# Altium project STM32H750VBT6.PrjPcb
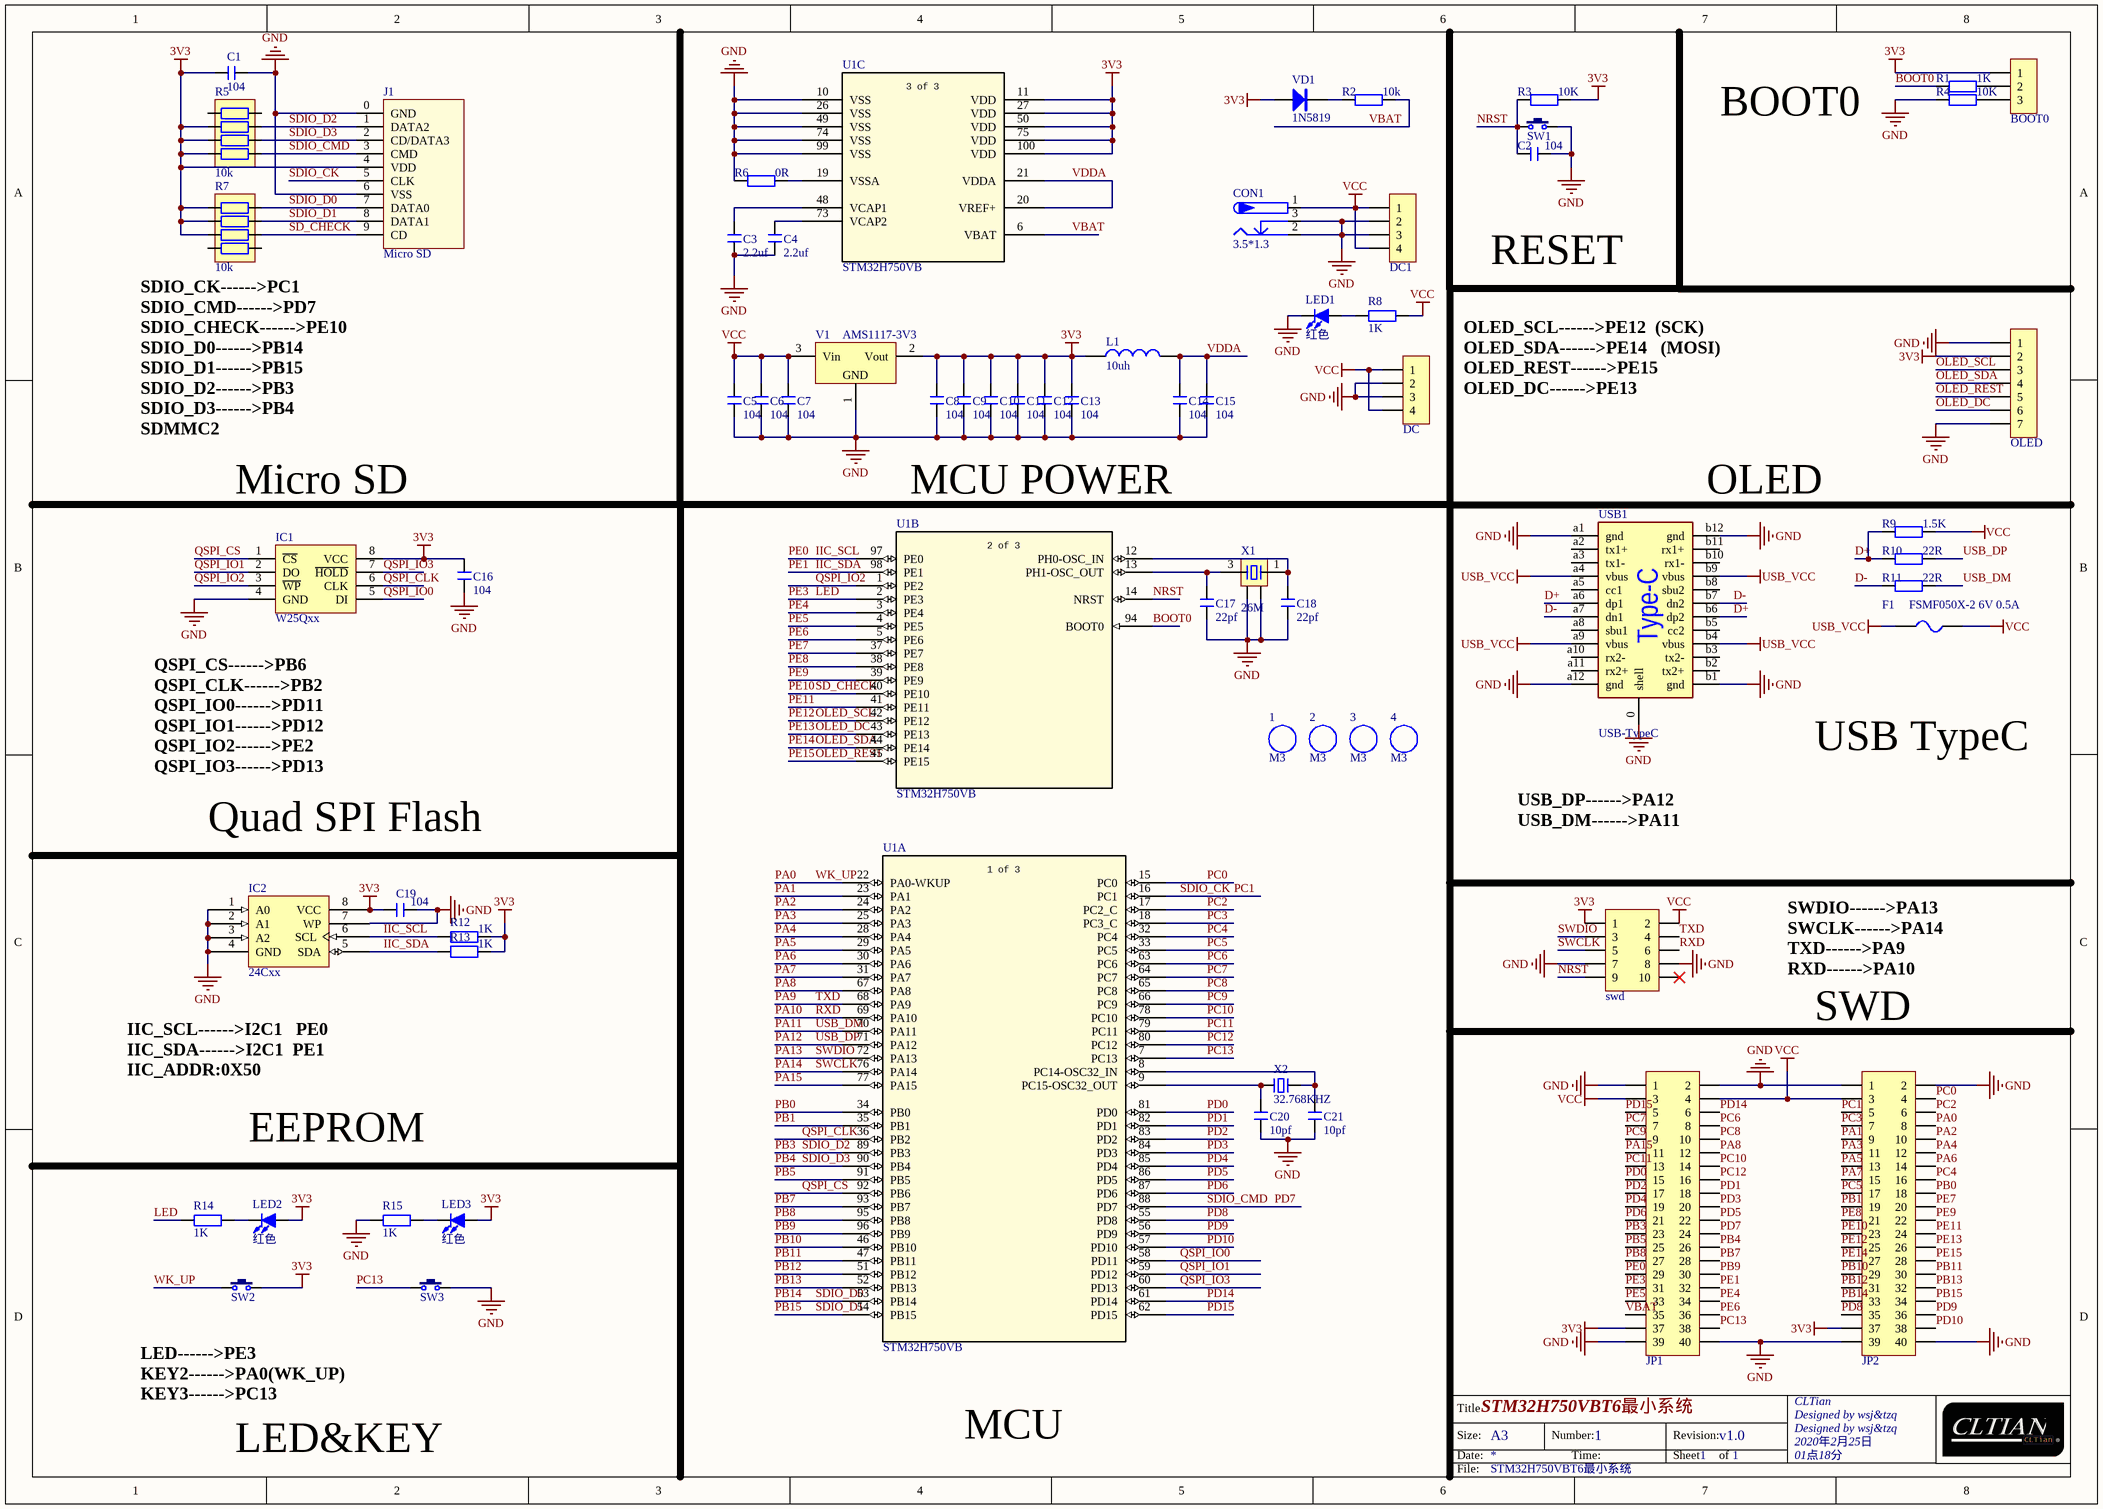
[diagram p0: Sheet1.SchDoc]
1 sheet, 65 parts. Net scope: global (net labels, ports and power ports of the same name join across sheets).
Board file: PCB1.PcbDoc

## Sheet Sheet1.SchDoc: STM32H750VBT6最小系统
size A3; CheckedBy: Designed by wsj&tzq; Author: Designed by wsj&tzq; DrawnBy: Designed by wsj&tzq; Engineer: 2020年2月25日; Organization: CLTian; Address1: Designed by wsj&tzq; Address2: 2020年2月25日; Address3: 01点18分; DocumentNumber: 1; Revision: v1.0; SheetNumber: 1; SheetTotal: 1; DocumentFullPathAndName: STM32H750VBT6最小系统; DocumentName: STM32H750VBT6最小系统; ImagePath: 01点18分; ProjectName: STM32H750VBT6最小系统

### Parts
1  M3  [M3 125X200]
2  M3  [M3 125X200]
3  M3  [M3 125X200]
4  M3  [M3 125X200]
BOOT0  HDR-1X3  [HDR-1X3]  (value not drawn)
C1  104  [C 0603]
C2  104  [C 0603]
C3  2.2uf  [C 0603]
C4  2.2uf  [C 0603]
C5  104  [C 0603]
C6  104  [C 0603]
C7  104  [C 0603]
C8  104  [C 0603]
C9  104  [C 0603]
C10  104  [C 0603]
C11  104  [C 0603]
C12  104  [C 0603]
C13  104  [C 0603]
C14  104  [C 0603]
C15  104  [C 0603]
C16  104  [C 0603]
C17  22pf  [C 0603]
C18  22pf  [C 0603]
C19  104  [C 0603]
C20  10pf  [C 0603]
C21  10pf  [C 0603]
CON1  3.5*1.3  [DC-005]
DC  HDR-1X4  [PH2.0 D-W-4P]  (value not drawn)
DC1  HDR-1X4  [PH2.0 D-W-4P]  (value not drawn)
F1  FSMF050X-2 6V 0.5A  [FU 0603]
IC1  W25Qxx  [SOP8W_N]
IC2  24Cxx  [SOP8_L]
J1  Micro SD  [Micro SD]
JP1  Header 2X11  [HDR-20X2]  (value not drawn)
JP2  Header 2X11  [HDR-20X2]  (value not drawn)
L1  10uh  [L 0603]
LED1  红色  [LED 0805G]
LED2  红色  [LED 0603B]
LED3  红色  [LED 0603B]
OLED  HDR-1X7  [HDR-1X7]  (value not drawn)
R1  1K  [R 0603-HP]
R2  10k  [R 0603-HP]
R3  10K  [R 0603-HP]
R4  10K  [R 0603-HP]
R5  10k  [RCA-8P4R-0402]
R6  0R  [R 0603-HP]
R7  10k  [RCA-8P4R-0402]
R8  1K  [R 0805]
R9  1.5K  [R 0603-HP]
R10  22R  [R 0603-HP]
R11  22R  [R 0603-HP]
R12  1K  [R 0603-HP]
R13  1K  [R 0603-HP]
R14  1K  [R 0603-HP]
R15  1K  [R 0603-HP]
SW1  3x6x5  [TSW SMD-3*6*2.5]  (value not drawn)
SW2  3x6x5  [TSW SMD-3*6*2.5]  (value not drawn)
SW3  3x6x5  [TSW SMD-3*6*2.5]  (value not drawn)
swd  Header 5X2  [HDR-5X2]  (value not drawn)
U1  STM32H750VB  [LQFP100-14x14mm]  (parts A,B,C of 3)
USB1  USB-TypeC  [USB_TypeC]
V1  AMS1117-3V3  [SOT223_L]
VD1  1N5819  [SOD-323]
X1  26M  [XTAL-3225]
X2  32.768KHZ  [XTAL-3215]

### Nets
3V3: BOOT0.1 C1.2 C8.2 C9.2 C10.2 C11.2 C12.2 C13.2 C16.2 C19.2 IC1.8(VCC) IC2.8(VCC) J1.4(VDD) JP1.37 JP2.37 L1.1 LED2.1(A) LED3.1(A) OLED.2 R3.1 R5.2 R5.3 R5.4 R7.1 R7.2 R7.3 R12.2 R13.2 SW2.2 swd.1 U1.11(VDD) U1.27(VDD) U1.50(VDD) U1.75(VDD) U1.100(VDD) V1.2(Vout) VD1.1(A)
GND: C1.1 C2.2 C3.1 C4.1 C5.1 C6.1 C7.1 C8.1 C9.1 C10.1 C11.1 C12.1 C13.1 C14.1 C15.1 C16.1 C17.1 C18.1 C19.1 C20.1 C21.1 CON1.2 CON1.3 DC.2 DC.3 DC1.2 DC1.3 IC1.4(GND) IC2.1(A0) IC2.2(A1) IC2.3(A2) IC2.4(GND) IC2.7(WP) J1.0(GND) J1.6(VSS) JP1.1 JP1.2 JP1.39 JP1.40 JP2.1 JP2.2 JP2.39 JP2.40 LED1.2(K) OLED.1 OLED.7 R4.1 R6.2 R15.1 SW1.2 SW3.2 swd.7 swd.8 U1.10(VSS) U1.26(VSS) U1.49(VSS) U1.74(VSS) U1.99(VSS) USB1.0(shell) USB1.a1(gnd) USB1.a12(gnd) USB1.b1(gnd) USB1.b12(gnd) V1.1(GND) X1.2 X1.4
USB_VCC: F1.1 USB1.a4(vbus) USB1.a9(vbus) USB1.b4(vbus) USB1.b9(vbus)
VCC: C5.2 C6.2 C7.2 CON1.1 DC.1 DC.4 DC1.1 DC1.4 F1.2 JP1.3 JP1.4 JP2.3 R8.2 R9.2 swd.2 V1.3(Vin)
BOOT0: R1.1 U1.94(BOOT0)
D+: R9.1 R10.1 USB1.a6(dp1) USB1.b6(dp2)
D-: R11.1 USB1.a7(dn1) USB1.b7(dn2)
IIC_SCL: IC2.6(SCL) JP1.29 R12.1 U1.97(PE0)  [also labelled PE0]
IIC_SDA: IC2.5(SDA) JP1.32 R13.1 U1.98(PE1)  [also labelled PE1]
LED: JP1.31 R14.1 U1.2(PE3)  [also labelled PE3]
NRST: C2.1 R3.2 SW1.1 swd.9 U1.14(NRST)
OLED_DC: JP2.26 OLED.6 U1.43(PE13)  [also labelled PE13]
OLED_REST: JP2.28 OLED.5 U1.45(PE15)  [also labelled PE15]
OLED_SCL: JP2.25 OLED.3 U1.42(PE12)  [also labelled PE12]
OLED_SDA: JP2.27 OLED.4 U1.44(PE14)  [also labelled PE14]
PA0: JP2.8 SW2.1 U1.22(PA0-WKUP)  [also labelled WK_UP]
PA1: JP2.9 U1.23(PA1)
PA2: JP2.10 U1.24(PA2)
PA3: JP2.11 U1.25(PA3)
PA4: JP2.12 U1.28(PA4)
PA5: JP2.13 U1.29(PA5)
PA6: JP2.14 U1.30(PA6)
PA7: JP2.15 U1.31(PA7)
PA8: JP1.12 U1.67(PA8)
PA9: swd.4 U1.68(PA9)  [also labelled TXD]
PA10: swd.6 U1.69(PA10)  [also labelled RXD]
PA11: R11.2 U1.70(PA11)  [also labelled USB_DM]
PA12: R10.2 U1.71(PA12)  [also labelled USB_DP]
PA13: swd.3 U1.72(PA13)  [also labelled SWDIO]
PA14: swd.5 U1.76(PA14)  [also labelled SWCLK]
PA15: JP1.11 U1.77(PA15)
PB0: JP2.18 U1.34(PB0)
PB1: JP2.19 U1.35(PB1)
PB3: J1.1(DATA2) JP1.23 R5.7 U1.89(PB3)  [also labelled SDIO_D2]
PB4: J1.2(CD/DATA3) JP1.26 R5.6 U1.90(PB4)  [also labelled SDIO_D3]
PB5: JP1.25 U1.91(PB5)
PB7: JP1.28 U1.93(PB7)
PB8: JP1.27 U1.95(PB8)
PB9: JP1.30 U1.96(PB9)
PB10: JP2.29 U1.46(PB10)
PB11: JP2.30 U1.47(PB11)
PB12: JP2.31 U1.51(PB12)
PB13: JP2.32 U1.52(PB13)
PB14: J1.7(DATA0) JP2.33 R7.8 U1.53(PB14)  [also labelled SDIO_D0]
PB15: J1.8(DATA1) JP2.34 R7.7 U1.54(PB15)  [also labelled SDIO_D1]
PC0: JP2.4 U1.15(PC0)
PC1: J1.5(CLK) JP2.5 U1.16(PC1)  [also labelled SDIO_CK]
PC2: JP2.6 U1.17(PC2_C)
PC3: JP2.7 U1.18(PC3_C)
PC4: JP2.16 U1.32(PC4)
PC5: JP2.17 U1.33(PC5)
PC6: JP1.8 U1.63(PC6)
PC7: JP1.7 U1.64(PC7)
PC8: JP1.10 U1.65(PC8)
PC9: JP1.9 U1.66(PC9)
PC10: JP1.14 U1.78(PC10)
PC11: JP1.13 U1.79(PC11)
PC12: JP1.16 U1.80(PC12)
PC13: JP1.38 SW3.1 U1.7(PC13)
PD0: JP1.15 U1.81(PD0)
PD1: JP1.18 U1.82(PD1)
PD2: JP1.17 U1.83(PD2)
PD3: JP1.20 U1.84(PD3)
PD4: JP1.19 U1.85(PD4)
PD5: JP1.22 U1.86(PD5)
PD6: JP1.21 U1.87(PD6)
PD7: J1.3(CMD) JP1.24 R5.5 U1.88(PD7)  [also labelled SDIO_CMD]
PD8: JP2.35 U1.55(PD8)
PD9: JP2.36 U1.56(PD9)
PD10: JP2.38 U1.57(PD10)
PD14: JP1.6 U1.61(PD14)
PD15: JP1.5 U1.62(PD15)
PE4: JP1.34 U1.3(PE4)
PE5: JP1.33 U1.4(PE5)
PE6: JP1.36 U1.5(PE6)
PE7: JP2.20 U1.37(PE7)
PE8: JP2.21 U1.38(PE8)
PE9: JP2.22 U1.39(PE9)
PE10: J1.9(CD) JP2.23 R7.6 U1.40(PE10)  [also labelled SD_CHECK]
PE11: JP2.24 U1.41(PE11)
QSPI_CLK: IC1.6(CLK) U1.36(PB2)
QSPI_CS: IC1.1(~{CS}) U1.92(PB6)
QSPI_IO0: IC1.5(DI) U1.58(PD11)
QSPI_IO1: IC1.2(DO) U1.59(PD12)
QSPI_IO2: IC1.3(~{WP}) U1.1(PE2)
QSPI_IO3: IC1.7(~{HOLD}) U1.60(PD13)
VBAT: JP1.35 R2.1 U1.6(VBAT)
VDDA: C14.2 C15.2 L1.2 U1.20(VREF+) U1.21(VDDA)
NetBOOT0_2: BOOT0.2 R1.2
NetBOOT0_3: BOOT0.3 R4.2
NetC3_2: C3.2 U1.48(VCAP1)
NetC4_2: C4.2 U1.73(VCAP2)
NetC17_2: C17.2 U1.13(PH1-OSC_OUT) X1.3
NetC18_2: C18.2 U1.12(PH0-OSC_IN) X1.1
NetC20_2: C20.2 U1.9(PC15-OSC32_OUT) X2.1
NetC21_2: C21.2 U1.8(PC14-OSC32_IN) X2.2
NetLED1_1: LED1.1(A) R8.1
NetLED2_2: LED2.2(K) R14.2
NetLED3_2: LED3.2(K) R15.2
NetR2_2: R2.2 VD1.2(K)
NetR6_1: R6.1 U1.19(VSSA)

Not connected (* = marked no-connect by the designer): R5 1 8; R7 4 5; swd 10*; USB1 a2(tx1+) a3(tx1-) a5(cc1) a8(sbu1) a10(rx2-) a11(rx2+) b2(tx2+) b3(tx2-) b5(cc2) b8(sbu2) b10(rx1-) b11(rx1+)

### Notes on the sheet
- BOOT0
- RESET
- OLED_SCL------>PE12  (SCK)
  OLED_SDA------>PE14   (MOSI)
  OLED_REST------>PE15
  OLED_DC------>PE13
- SDIO_CK------>PC1
  SDIO_CMD------>PD7
  SDIO_CHECK------>PE10
  SDIO_D0------>PB14
  SDIO_D1------>PB15
  SDIO_D2------>PB3
  SDIO_D3------>PB4
  SDMMC2
- Micro SD
- MCU POWER
- (near USB1) OLED
- QSPI_CS------>PB6
  QSPI_CLK------>PB2
  QSPI_IO0------>PD11
  QSPI_IO1------>PD12
  QSPI_IO2------>PE2
  QSPI_IO3------>PD13
- USB TypeC
- Quad SPI Flash
- USB_DP------>PA12
  USB_DM------>PA11
- SWDIO------>PA13
  SWCLK------>PA14
  TXD------>PA9
  RXD------>PA10
- SWD
- IIC_SCL------>I2C1   PE0
  IIC_SDA------>I2C1  PE1
  IIC_ADDR:0X50
- EEPROM
- LED------>PE3
  KEY2------>PA0(WK_UP)
  KEY3------>PC13
- LED&KEY
- MCU
- Title
- Size:
- Date:
- A3
- Number:
- Time:
- Revision:
- Sheet
- of
- File:
- (in symbol STM32H750VBTx, part A) 1 of 3
- (in symbol STM32H750VBTx, part B) 2 of 3
- (in symbol STM32H750VBTx, part C) 3 of 3
- (in symbol USB_TypeC) Type-C

### Library data of the parts
1-4 = M3: 铜柱孔; 版权归属: 黎明电子style; BOM名称: 铜柱孔; 学习资源: https://lmdzstyle.taobao.com/
BOOT0 = Header 3: 3P接插件; 版权归属: 黎明电子style; BOM名称: 3P接插件; 学习资源: https://lmdzstyle.taobao.com/
C1-C21 = C: 无极性贴片电容; 版权归属: 黎明电子style; BOM名称: 无极性贴片电容; 学习资源: https://lmdzstyle.taobao.com/
CON1 = P-DC: 低压电源接口; BOM名称: DC电源接口; 版权归属: 黎明电子style; 学习资源: https://lmdzstyle.taobao.com/
DC DC1 = Header 4: 4P接插件; 版权归属: 黎明电子style; BOM名称: 4P接插件; 学习资源: https://lmdzstyle.taobao.com/
F1 = FU: 贴片保险丝; 版权归属: 黎明电子style; BOM名称: 贴片保险丝; 学习资源: https://lmdzstyle.taobao.com/
IC1 = W25Qxx: 外置Flash; 版权归属: 黎明电子style; BOM名称: 外置Flash; 学习资源: https://lmdzstyle.taobao.com/
IC2 = 24Cxx: 外置EEPROM; 版权归属: 源创客; BOM名称: 外置EEPROM; 学习资源: https://lmdzstyle.taobao.com/
J1 = Micro SD: Micro SD卡; 版权归属: 黎明电子style; BOM名称: Micro SD卡; 学习资源: https://lmdzstyle.taobao.com/
JP1 JP2 = Header 20X2: 20*2P接插件; 版权归属: 黎明电子style; BOM名称: 20*2P接插件; 学习资源: https://lmdzstyle.taobao.com/
L1 = L: 小功率贴片电感; 版权归属: 黎明电子style; BOM名称: 小功率贴片电感; 学习资源: https://lmdzstyle.taobao.com/
LED1-LED3 = LED-SMD: 贴片LED; 版权归属: 黎明电子style; BOM名称: 贴片LED; 学习资源: https://lmdzstyle.taobao.com/
OLED = Header 7: 7P接插件; 版权归属: 黎明电子style; BOM名称: 7P接插件; 学习资源: https://lmdzstyle.taobao.com/
R1-R4 R6 R8-R15 = R: 贴片电阻; 版权归属: 黎明电子style; BOM名称: 贴片电阻; 学习资源: https://lmdzstyle.taobao.com/
R5 R7 = R-8P4R: 贴片网络排阻; 版权归属: 黎明电子style; BOM名称: 贴片网络排阻; 学习资源: https://lmdzstyle.taobao.com/
SW1-SW3 = TSW 3x6: 3x6轻触开关; 版权归属: 黎明电子style; BOM名称: 3x6轻触开关; 学习资源: https://lmdzstyle.taobao.com/
swd = Header 5X2: 5*2P接插件; 版权归属: 黎明电子style; BOM名称: 5*2P接插件; 学习资源: https://lmdzstyle.taobao.com/
U1 = STM32H750VBTx: 32位单片机100引脚；; 资源描述: stm32h750vbtx
USB1 = USB_TypeC: USB-TypeC型母接口
V1 = AMS1117: 三端稳压芯片; BOM名称: 稳压芯片; 版权归属: 黎明电子style; 学习资源: https://lmdzstyle.taobao.com/
VD1 = 1N4148: 高速开关二极管; 版权归属: 黎明电子style; BOM名称: 高速开关二极管; 学习资源: https://lmdzstyle.taobao.com/
X1 = XTAL-4: 4脚晶振; 版权归属: 黎明电子style; BOM名称: 4脚晶振; 学习资源: https://lmdzstyle.taobao.com/
X2 = XTAL-2: 2脚晶振; 版权归属: 黎明电子style; BOM名称: 2脚晶振; 学习资源: https://lmdzstyle.taobao.com/